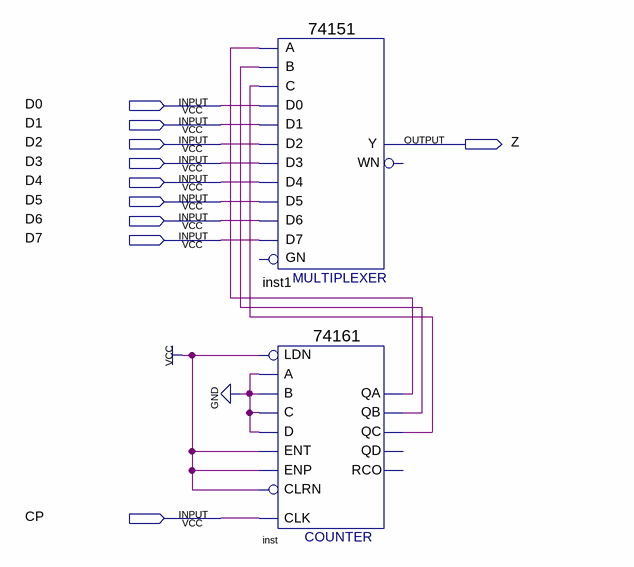
[diagram p0: schematic sheet]
// Quartus schematic Experiment72.bdf as structural Verilog: 2 symbols, 10 pins
module Experiment72 (
  input  D0,
  input  D1,
  input  D2,
  input  D3,
  input  D4,
  input  D5,
  input  D6,
  input  D7,
  input  CP,
  output Z
);

  wire inst_qa, inst_qb, inst_qc;

  \74151  inst1 (
    .C(inst_qc), .B(inst_qb), .A(inst_qa), .D5(D5), .D0(D0), .D1(D1), .D4(D4), .D3(D3), .D2(D2), .D6(D6),
    .D7(D7), .Y(Z));  // open: GN, WN
  \74161  inst (
    .CLRN(1'b1), .CLK(CP), .ENP(1'b1), .LDN(1'b1), .A(1'b0), .D(1'b0), .ENT(1'b1), .B(1'b0), .C(1'b0),
    .QC(inst_qc), .QB(inst_qb), .QA(inst_qa));  // open: QD, RCO
endmodule
